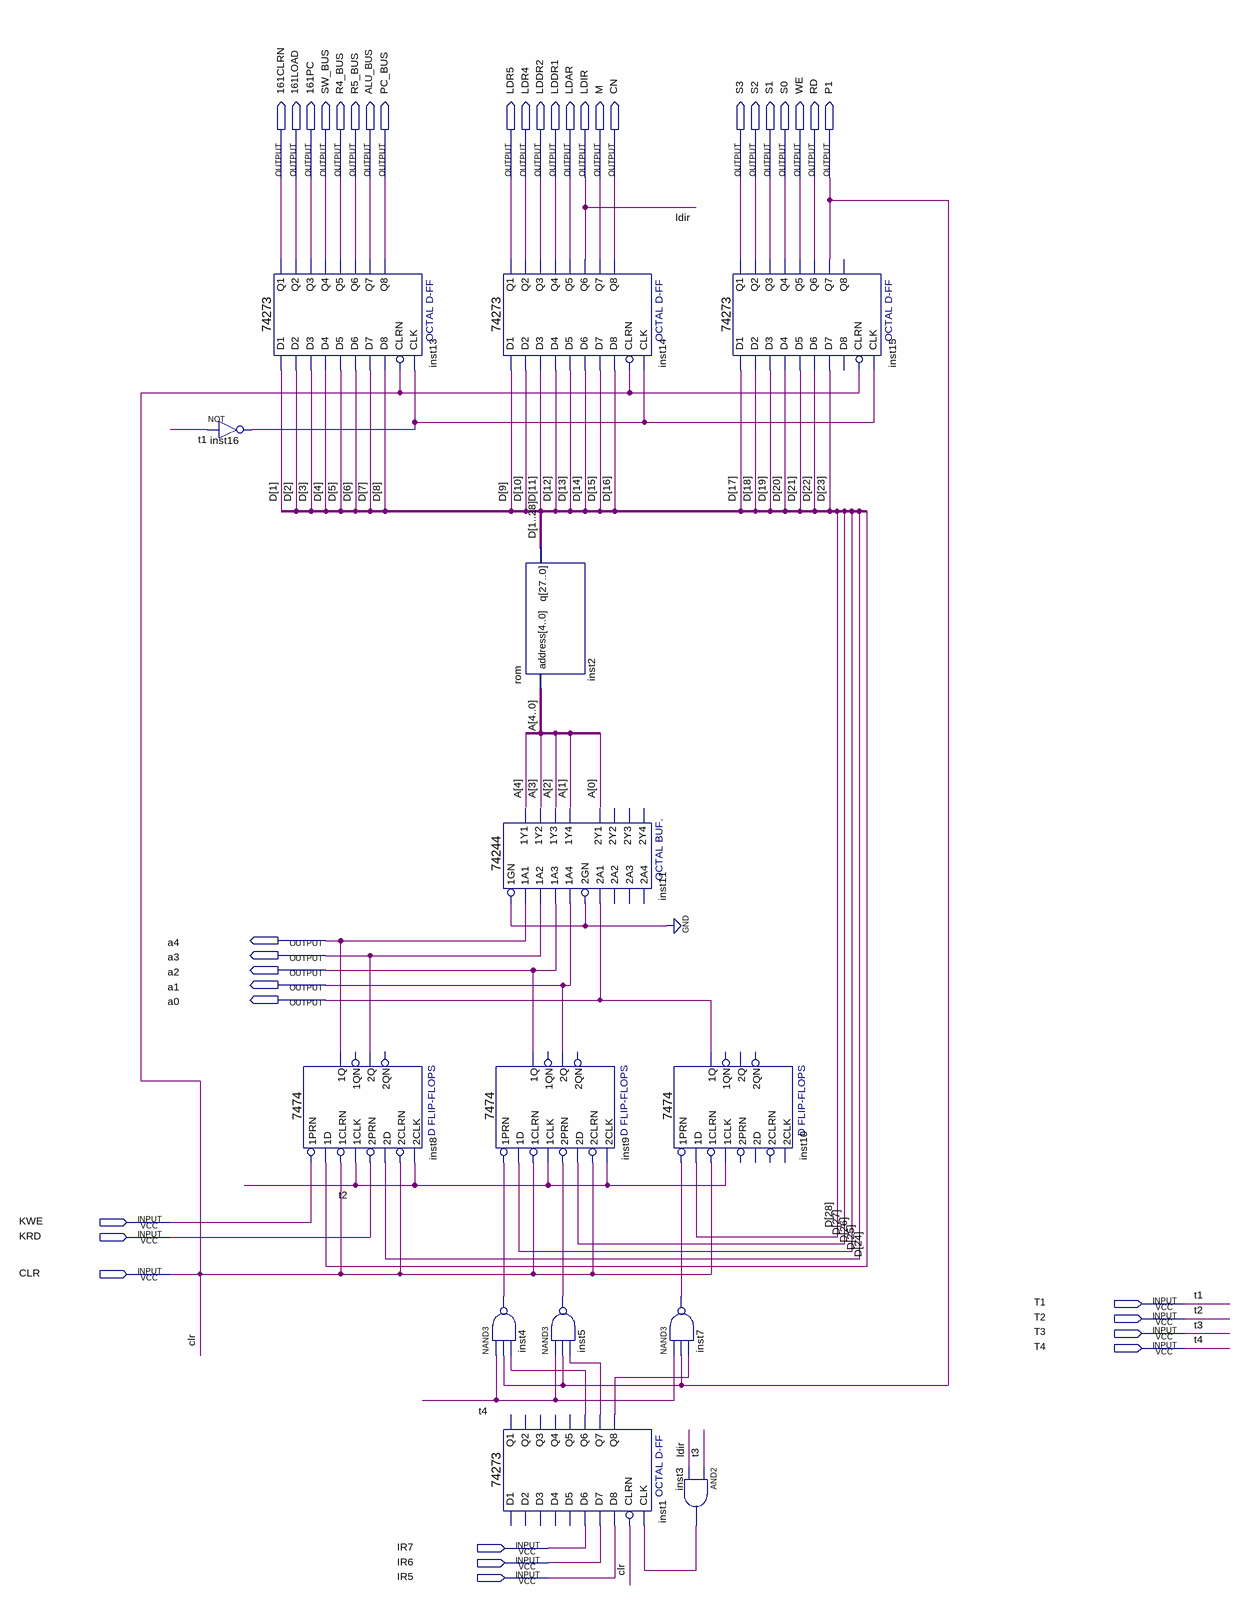
[diagram p0: schematic sheet]
// Quartus schematic Control.bdf as structural Verilog: 14 symbols, 38 pins
module Control (
  input  KWE,
  input  KRD,
  input  CLR,
  input  T1,
  input  T2,
  input  T3,
  input  T4,
  input  IR7,
  input  IR6,
  input  IR5,
  output \161CLRN ,
  output \161LOAD ,
  output \161PC ,
  output SW_BUS,
  output R4_BUS,
  output R5_BUS,
  output ALU_BUS,
  output PC_BUS,
  output LDR5,
  output LDR4,
  output LDDR2,
  output LDDR1,
  output LDAR,
  output LDIR,
  output M,
  output CN,
  output S3,
  output S2,
  output S1,
  output S0,
  output WE,
  output RD,
  output P1,
  output a4,
  output a3,
  output a2,
  output a1,
  output a0
);

  wire inst1_q6, inst1_q7, inst1_q8, inst3_out, inst4_out, inst5_out, inst7_out, inst16_out;
  wire [28:1] D;

  not inst16 (inst16_out, T1);
  \74273  inst13 (
    .D2(D[2]), .D3(D[3]), .D1(D[1]), .D4(D[4]), .D7(D[7]), .D6(D[6]), .D5(D[5]), .D8(D[8]), .CLK(inst16_out),
    .CLRN(CLR), .Q4(SW_BUS), .Q1(\161CLRN ), .Q2(\161LOAD ), .Q3(\161PC ), .Q6(R5_BUS), .Q5(R4_BUS),
    .Q7(ALU_BUS), .Q8(PC_BUS));
  \7474  inst8 (
    .\2D (D[25]), .\2PRN (KRD), .\1CLK (T2), .\1D (D[24]), .\1PRN (KWE), .\2CLK (T2), .\2CLRN (CLR),
    .\1CLRN (CLR), .\2Q (a3), .\1Q (a4));  // open: 1QN, 2QN
  \74273  inst14 (
    .D2(D[10]), .D3(D[11]), .D1(D[9]), .D4(D[12]), .D7(D[15]), .D6(D[14]), .D5(D[13]), .D8(D[16]),
    .CLK(inst16_out), .CLRN(CLR), .Q4(LDDR1), .Q1(LDR5), .Q2(LDR4), .Q3(LDDR2), .Q6(LDIR), .Q5(LDAR), .Q7(M),
    .Q8(CN));
  rom inst2 (
    .address({a4, a3, a2, a1, a0}),
    .q({D[1], D[2], D[3], D[4], D[5], D[6], D[7], D[8], D[9], D[10], D[11], D[12], D[13], D[14], D[15], D[16], D[17], D[18], D[19], D[20], D[21], D[22], D[23], D[24], D[25], D[26], D[27], D[28]}));
  \74244  inst11 (
    .\1A2 (a3), .\1A4 (a1), .\1A1 (a4), .\1A3 (a2), .\1GN (1'b0), .\2GN (1'b0), .\2A1 (a0), .\1Y2 (a3),
    .\1Y4 (a1), .\2Y1 (a0), .\1Y1 (a4), .\1Y3 (a2));  // open: 2A3, 2A4, 2A2, 2Y3, 2Y4, 2Y2
  \7474  inst9 (
    .\2D (D[27]), .\2PRN (inst5_out), .\1CLK (T2), .\1D (D[26]), .\1PRN (inst4_out), .\2CLK (T2),
    .\2CLRN (CLR), .\1CLRN (CLR), .\2Q (a1), .\1Q (a2));  // open: 1QN, 2QN
  nand inst4 (inst4_out, T4, P1, inst1_q6);
  \74273  inst1 (
    .D7(IR6), .D6(IR7), .D8(IR5), .CLK(inst3_out), .CLRN(CLR), .Q6(inst1_q6), .Q7(inst1_q7), .Q8(inst1_q8));  // open: D2, D3, D1, D4, D5, Q4, Q1, Q2, Q3, Q5
  nand inst5 (inst5_out, T4, P1, inst1_q7);
  \7474  inst10 (
    .\1CLK (T2), .\1D (D[28]), .\1PRN (inst7_out), .\1CLRN (CLR), .\1Q (a0));  // open: 2D, 2PRN, 2CLK, 2CLRN, 1QN, 2Q, 2QN
  nand inst7 (inst7_out, T4, P1, inst1_q8);
  and inst3 (inst3_out, T3, LDIR);
  \74273  inst15 (
    .D2(D[18]), .D3(D[19]), .D1(D[17]), .D4(D[20]), .D7(D[23]), .D6(D[22]), .D5(D[21]), .CLK(inst16_out),
    .CLRN(CLR), .Q4(S0), .Q1(S3), .Q2(S2), .Q3(S1), .Q6(RD), .Q5(WE), .Q7(P1));  // open: D8, Q8
endmodule
